# EAGLE schematic DUE_V02g (EAGLE 9.6.2)

## Sheet 1 of 2
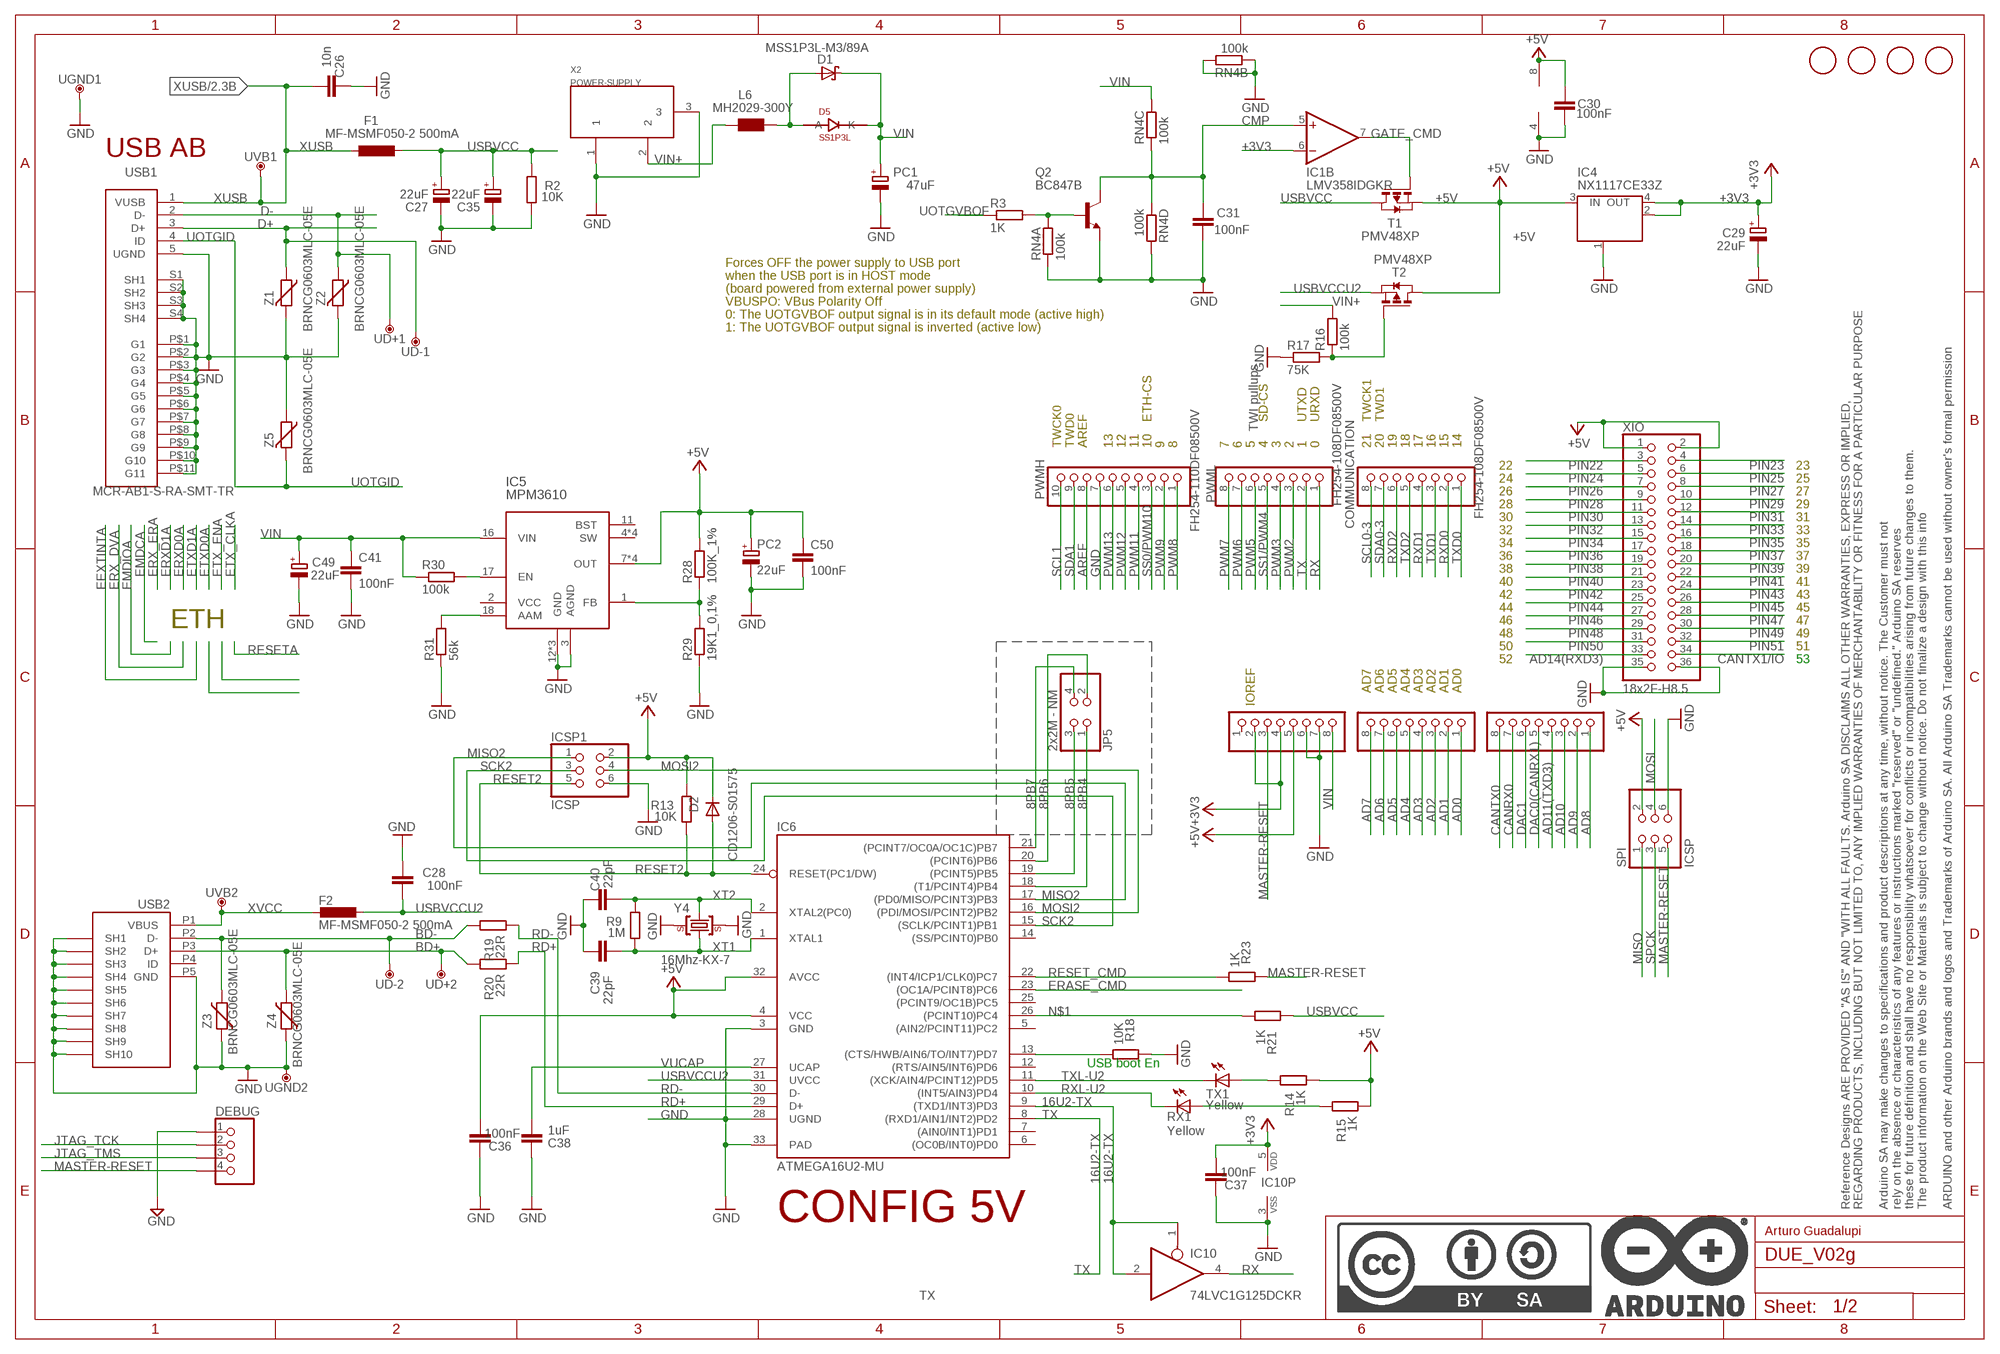
[diagram p0: schematic, sheet 1]

### Parts
ADCH  FH254-108DF08500V  1683_20TW-536  [1X08]
ADCL  FH254-108DF08500V  1683_20TW-536  [1X08]
C26  10n  0165_10NF_0402  [C0402]
C27  22uF  0167_  [SMC_B]
C28  100nF  0132_100NF_0402  [C0402]
C29  22uF  0167_  [SMC_B]
C30  100nF  0132_100NF_0402  [C0402]
C31  100nF  0132_100NF_0402  [C0402]
C35  22uF  0167_  [SMC_B]
C36  100nF  0132_100NF_0402  [C0402]
C37  100nF  0132_100NF_0402  [C0402]
C38  1uF  0133_1UF_0402  [C0402]
C39  22pF  0137_22PF_0402  [C0402]
C40  22pF  0137_22PF_0402  [C0402]
C41  100nF  0015_100NF_0603  [C0603-ROUND]
C49  22uF  0167_  [SMC_B]
C50  100nF  0015_100NF_0603  [C0603-ROUND]
COMMUNICATION  FH254-108DF08500V  1683_20TW-536  [1X08]
D1  MSS1P3L-M3/89A  1653_MSS1P3L-M3/89A  [MICROSMP]
D2  CD1206-S01575  0012_CD1206-S01575  [MINIMELF]
D5  SS1P3L  0025_SS1P3L-M3/84A  [DO220AAL]
DEBUG  0644_4X1VP.2,54H11,8  [PH1X4-THT]
F1  MF-MSMF050-2 500mA  0002_MF-MSMF050-2  [L1812]
F2  MF-MSMF050-2 500mA  0002_MF-MSMF050-2  [L1812]
FID1  FIDUCIALMOUNT  [FIDUCIA-MOUNT]
FID2  FIDUCIALMOUNT  [FIDUCIA-MOUNT]
FID3  FIDUCIALMOUNT  [FIDUCIA-MOUNT]
FID4  FIDUCIALMOUNT  [FIDUCIA-MOUNT]
IC1  LMV358IDGKR  0021_LMV358IDGKR  [MSOP08]
IC4  NX1117CE33Z  0045_NX1117CE33Z,115  [SOT223]
IC5  MPM3610  2093_MPM3610GQV-P  [QFN-20]
IC6  ATMEGA16U2-MU  0007_ATMEGA16U2-MUR  [MLF32]
IC10  74LVC1G125DCKR  0040_SN74LVC1G125DCKR  [SC70-5]
ICSP1  ICSP  0114_PH254-203DF118A00V  [2X03]
JP5  2x2M - NM  XXXX_PINHD-2X2  [2X02]
L6  MH2029-300Y  0001_BLM21PG300SN1D_/_MH2029-300Y  [0805]
PC1  47uF  0113_47UF  [PANASONIC_D]
PC2  22uF  0167_  [SMC_B]
POWER  FH254-108DF08500V  1683_20TW-536  [1X08]
PWMH  FH254-110DF08500V  1684_20TW-537  [1X10]
PWML  FH254-108DF08500V  1683_20TW-536  [1X08]
Q2  BC847B  0169_BC847B  [SOT23]
R2  10K  0136_CR0402FX1002_L  [R0402]
R3  1K  0140_1K_0402  [R0402]
R9  1M  0139_1M_0402  [R0402]
R13  10K  0136_CR0402FX1002_L  [R0402]
R14  1K  0140_1K_0402  [R0402]
R15  1K  0140_1K_0402  [R0402]
R16  100k  0134_CR0402FX1003L  [R0402]
R17  75K  0376_CR0603FX7502_L  [R0603-ROUND]
R18  10K  0136_CR0402FX1002_L  [R0402]
R19  22R  0468_22R_0402  [R0402]
R20  22R  0468_22R_0402  [R0402]
R21  1K  0140_1K_0402  [R0402]
R23  1K  0140_1K_0402  [R0402]
R28  100K_1%  2022_CR0603FW104L  [R0603-ROUND]
R29  19K1_0,1%  2339_  [R0603-ROUND]
R30  100k  0026_100K_0603  [R0603-ROUND]
R31  56k  0411_56K_0603  [R0603-ROUND]
RN4  100k  0168_CAY16-104J4LF  [CAY16]
RX1  Yellow  0044_KPT-2012YC  [CHIPLED_0805]
SPI  ICSP  0114_PH254-203DF118A00V  [2X03]
T1  PMV48XP  0297_PMV48XP  [SOT-23]
T2  PMV48XP  0297_PMV48XP  [SOT-23]
TX1  Yellow  0044_KPT-2012YC  [CHIPLED_0805]
U$1  DNP  A3-FRAME  [FRAME]
UD+1  DNP  TPTP-1.00MM  [TP-1.00MM]
UD+2  DNP  TPTP-1.00MM  [TP-1.00MM]
UD-1  DNP  TPTP-1.00MM  [TP-1.00MM]
UD-2  DNP  TPTP-1.00MM  [TP-1.00MM]
UGND1  DNP  TPTP-1.00MM  [TP-1.00MM]
UGND2  DNP  TPTP-1.00MM  [TP-1.00MM]
USB1  MCR-AB1-S-RA-SMT-TR  0631_MCR-AB1-S-RA-SMT-TR  [MCR-AB1-S-RA-SMT]
USB2  MCR-B-S-RA-SMT-CS1TR  0158_MCR-B-S-RA-SMT-CS1TR  [CON2_USB_MICRO_B_AT]
UVB1  DNP  TPTP-1.00MM  [TP-1.00MM]
UVB2  DNP  TPTP-1.00MM  [TP-1.00MM]
X2  POWER-SUPPLY  0018_19746-POWER-SUPPLY  [POWERSUPPLY_DC-21MM]
XIO  18x2F-H8.5  1756_12TW323  [2X18]
Y4  16Mhz-KX-7  0395_16.000MHZ__12PF  [CRYSTAL-3.2-2.5]
Z1  BRNCG0603MLC-05E  0010_BRNCG0603MLC-05E  [CT/CN0603]
Z2  BRNCG0603MLC-05E  0010_BRNCG0603MLC-05E  [CT/CN0603]
Z3  BRNCG0603MLC-05E  0010_BRNCG0603MLC-05E  [CT/CN0603]
Z4  BRNCG0603MLC-05E  0010_BRNCG0603MLC-05E  [CT/CN0603]
Z5  BRNCG0603MLC-05E  0010_BRNCG0603MLC-05E  [CT/CN0603]

### Nets
8PB4: IC6.18((T1/PCINT4)PB4) JP5.1
8PB5: IC6.19((PCINT5)PB5) JP5.3
8PB6: IC6.20((PCINT6)PB6) JP5.2
8PB7: IC6.21((PCINT7/OC0A/OC1C)PB7) JP5.4
16U2-TX: IC6.9((TXD1/INT3)PD3) IC10.1(OE) IC10.2(I)
+3V3: C29.+ C37.1 IC1.6(B:-IN) IC4.2(OUT) IC4.4(OUT) IC10.5(VDD) POWER.2 POWER.4 ; also sheet 2
+5V: C30.2 C36.1 C50.1 D2.C IC1.8(P:V+) IC4.3(IN) IC5.7(OUT) IC5.8(OUT) IC5.9(OUT) IC5.20(OUT) IC6.4(VCC) IC6.32(AVCC) ICSP1.2 PC2.+ POWER.5 R13.2 R14.1 R15.1 R28.2 SPI.2 T1.2(S) T2.1(D) XIO.1 XIO.2
AD0: ADCL.1 ; also sheet 2
AD1: ADCL.2 ; also sheet 2
AD2: ADCL.3 ; also sheet 2
AD3: ADCL.4 ; also sheet 2
AD4: ADCL.5 ; also sheet 2
AD5: ADCL.6 ; also sheet 2
AD6: ADCL.7 ; also sheet 2
AD7: ADCL.8 ; also sheet 2
AD8: ADCH.1 ; also sheet 2
AD9: ADCH.2 ; also sheet 2
AD10: ADCH.3 ; also sheet 2
AD11(TXD3): ADCH.4 ; also sheet 2
AD14(RXD3): XIO.33 ; also sheet 2
AREF: PWMH.8 ; also sheet 2
BD+ [USB]: R20.2 UD+2.X USB2.P3(D+) Z4.2
BD- [USB]: R19.2 UD-2.X USB2.P2(D-) Z3.2
CANRX0: ADCH.7 ; also sheet 2
CANTX0: ADCH.8 ; also sheet 2
CANTX1/IO: XIO.34 ; also sheet 2
CMP: C31.2 IC1.5(B:+IN) Q2.3(C) RN4.3 RN4.4
D+ [USBpair]: UD-1.X USB1.3(D+) Z1.1 ; also sheet 2
D- [USBpair]: UD+1.X USB1.2(D-) Z2.1 ; also sheet 2
DAC0(CANRX1): ADCH.5 ; also sheet 2
DAC1: ADCH.6 ; also sheet 2
DTR: IC6.13((CTS/HWB/AIN6/TO/INT7)PD7) R18.1
ERASE_CMD: IC6.23((OC1A/PCINT8)PC6) ; also sheet 2
GATE_CMD: IC1.7(B:OUT) T1.3(G)
GND: C26.2 C27.- C28.2 C29.- C30.1 C31.1 C35.- C36.2 C37.2 C38.2 C39.2 C40.2 C41.2 C49.- C50.2 DEBUG.1 IC1.4(P:V-) IC4.1(GND/ADJ) IC5.3(AGND) IC5.12(GND) IC5.13(GND) IC5.14(GND) IC6.3(GND) IC6.28(UGND) IC6.33(PAD) IC10.3(VSS) ICSP1.6 PC1.- PC2.- POWER.6 POWER.7 PWMH.7 Q2.2(E) R2.1 R17.1 R18.2 R29.1 R31.1 RN4.1 RN4.2 RN4.5 RN4.7 SPI.6 UGND1.X UGND2.X USB1.5(UGND) USB1.P$1(G1) USB1.P$2(G2) USB1.P$3(G3) USB1.P$4(G4) USB1.P$5(G5) USB1.P$6(G6) USB1.P$7(G7) USB1.P$8(G8) USB1.P$9(G9) USB1.P$10(G10) USB1.P$11(G11) USB1.S1(SH1) USB1.S2(SH2) USB1.S3(SH3) USB1.S4(SH4) USB2.P5(GND) USB2.P$1(SH7) USB2.P$2(SH8) USB2.P$3(SH9) USB2.P$4(SH10) USB2.P$5(SH7) USB2.P$6(SH8) USB2.P$7(SH9) USB2.P$8(SH10) USB2.S1(SH1) USB2.S2(SH2) USB2.S3(SH3) USB2.S4(SH4) USB2.S5(SH5) USB2.S6(SH6) X2.1 X2.3 XIO.35 XIO.36 Y4.2(GND) Y4.4(GND) Z1.2 Z2.2 Z3.1 Z4.1 Z5.1 ; also sheet 2
JTAG_TCK: DEBUG.2 ; also sheet 2
JTAG_TMS: DEBUG.3 ; also sheet 2
MASTER-RESET: DEBUG.4 POWER.3 R23.2 SPI.5 ; also sheet 2
MISO: SPI.1 ; also sheet 2
MISO2: IC6.17((PD0/MISO/PCINT3)PB3) ICSP1.1
MOSI: SPI.4 ; also sheet 2
MOSI2: IC6.16((PDI/MOSI/PCINT2)PB2) ICSP1.4
N$1: IC6.26((PCINT10)PC4) R21.1
N$4: R15.2 RX1.A
N$6: Q2.1(B) R3.2 RN4.8
N$10: D1.A D5.P$2(A) L6.1
N$14: R14.2 TX1.A
N$15: R16.1 R17.2 T2.3(G)
N$35: IC5.1(FB) R28.1 R29.2
N$36: IC5.17(EN) R30.2
N$37: IC5.18(AAM) R31.2
PIN22: XIO.3 ; also sheet 2
PIN23: XIO.4 ; also sheet 2
PIN24: XIO.5 ; also sheet 2
PIN25: XIO.6 ; also sheet 2
PIN26: XIO.7 ; also sheet 2
PIN27: XIO.8 ; also sheet 2
PIN28: XIO.9 ; also sheet 2
PIN29: XIO.10 ; also sheet 2
PIN30: XIO.11 ; also sheet 2
PIN31: XIO.12 ; also sheet 2
PIN32: XIO.13 ; also sheet 2
PIN33: XIO.14 ; also sheet 2
PIN34: XIO.15 ; also sheet 2
PIN35: XIO.16 ; also sheet 2
PIN36: XIO.17 ; also sheet 2
PIN37: XIO.18 ; also sheet 2
PIN38: XIO.19 ; also sheet 2
PIN39: XIO.20 ; also sheet 2
PIN40: XIO.21 ; also sheet 2
PIN41: XIO.22 ; also sheet 2
PIN42: XIO.23 ; also sheet 2
PIN43: XIO.24 ; also sheet 2
PIN44: XIO.25 ; also sheet 2
PIN45: XIO.26 ; also sheet 2
PIN46: XIO.27 ; also sheet 2
PIN47: XIO.28 ; also sheet 2
PIN48: XIO.29 ; also sheet 2
PIN49: XIO.30 ; also sheet 2
PIN50: XIO.31 ; also sheet 2
PIN51: XIO.32 ; also sheet 2
PWM2: PWML.3 ; also sheet 2
PWM3: PWML.4 ; also sheet 2
PWM5: PWML.6 ; also sheet 2
PWM6: PWML.7 ; also sheet 2
PWM7: PWML.8 ; also sheet 2
PWM8: PWMH.1 ; also sheet 2
PWM9: PWMH.2 ; also sheet 2
PWM11: PWMH.4 ; also sheet 2
PWM12: PWMH.5 ; also sheet 2
PWM13: PWMH.6 ; also sheet 2
RD+: IC6.29(D+) R20.1
RD-: IC6.30(D-) R19.1
RESET2: D2.A IC6.24(RESET(PC1/DW)) ICSP1.5 R13.1
RESET_CMD: IC6.22((INT4/ICP1/CLK0)PC7) R23.1
RX: IC10.4(O) PWML.1 ; also sheet 2
RXD0: COMMUNICATION.2 ; also sheet 2
RXD1: COMMUNICATION.4 ; also sheet 2
RXD2: COMMUNICATION.6 ; also sheet 2
RXL-U2: IC6.10((INT5/AIN3)PD4) RX1.C
SCK2: IC6.15((SCLK/PCINT1)PB1) ICSP1.3
SCL0-3: COMMUNICATION.8 ; also sheet 2
SCL1: PWMH.10 ; also sheet 2
SDA0-3: COMMUNICATION.7 ; also sheet 2
SDA1: PWMH.9 ; also sheet 2
SPCK: SPI.3 ; also sheet 2
SS0/PWM10: PWMH.3 ; also sheet 2
SS1/PWM4: PWML.5 ; also sheet 2
TX: IC6.8((RXD1/AIN1/INT2)PD2) PWML.2 ; also sheet 2
TXD0: COMMUNICATION.1 ; also sheet 2
TXD1: COMMUNICATION.3 ; also sheet 2
TXD2: COMMUNICATION.5 ; also sheet 2
TXL-U2: IC6.11((XCK/AIN4/PCINT12)PD5) TX1.C
UOTGID: USB1.4(ID) Z5.2 ; also sheet 2
UOTGVBOF: R3.1 ; also sheet 2
USBVCC: C27.+ C35.+ F1.1 R2.2 R21.2 T1.1(D)
USBVCCU2: C28.1 F2.1 IC6.31(UVCC) T2.2(S)
VIN: C41.1 C49.+ D1.K(C) D5.P$1(K) IC5.16(VIN) PC1.+ POWER.8 R30.1 RN4.6
VIN+: L6.2 R16.2 X2.2
VUCAP: C38.1 IC6.27(UCAP)
XT1: C39.1 IC6.1(XTAL1) R9.1 Y4.1(C1)
XT2: C40.1 IC6.2(XTAL2(PC0)) R9.2 Y4.3(C2)
XUSB [usbvcc]: C26.1 F1.2 USB1.1(VUSB) UVB1.X ; also sheet 2
XVCC [usbvcc]: F2.2 USB2.P1(VBUS) UVB2.X
Unconnected: IC5.2(VCC) IC5.4(SW) IC5.5(SW) IC5.6(SW) IC5.11(BST) IC5.19(SW) IC6.5((AIN2/PCINT11)PC2) IC6.6((OC0B/INT0)PD0) IC6.7((AIN0/INT1)PD1) IC6.12((RTS/AIN5/INT6)PD6) IC6.14((SS/PCINT0)PB0) IC6.25((PCINT9/OC1B)PC5) POWER.1 USB2.P4(ID)

### Notes on the sheet
- USB AB
- Forces OFF the power supply to USB port
- when the USB port is in HOST mode
- (board powered from external power supply)
- VBUSPO: VBus Polarity Off
- 0: The UOTGVBOF output signal is in its default mode (active high)
- 1: The UOTGVBOF output signal is inverted (active low)
- ETH-CS | SD-CS | UTXD | URXD | TWCK1 | TWD1
- TWI pullups
- TWCK0 | TWD0 | AREF | 13 | 12 | 11 | 10 | 9 | 8 | 7 | 6 | 5 | 4 | 3 | 2 | 1 | 0 | 21 | 20 | 19 | 18 | 17 | 16 | 15 | 14
- 22 | 23
- 24 | 25
- 26 | 27
- 28 | 29
- 30 | 31
- 32 | 33
- 34 | 35
- 36 | 37
- 38 | 39
- 40 | 41
- 42 | 43
- 44 | 45
- 46 | 47
- ETH | 48 | 49
- 50 | 51
- 52 | 53
- AD7 | AD6 | AD5 | AD4 | AD3 | AD2 | AD1 | AD0
- IOREF
- USB boot En
- CONFIG 5V
- Arturo Guadalupi

## Sheet 2 of 2
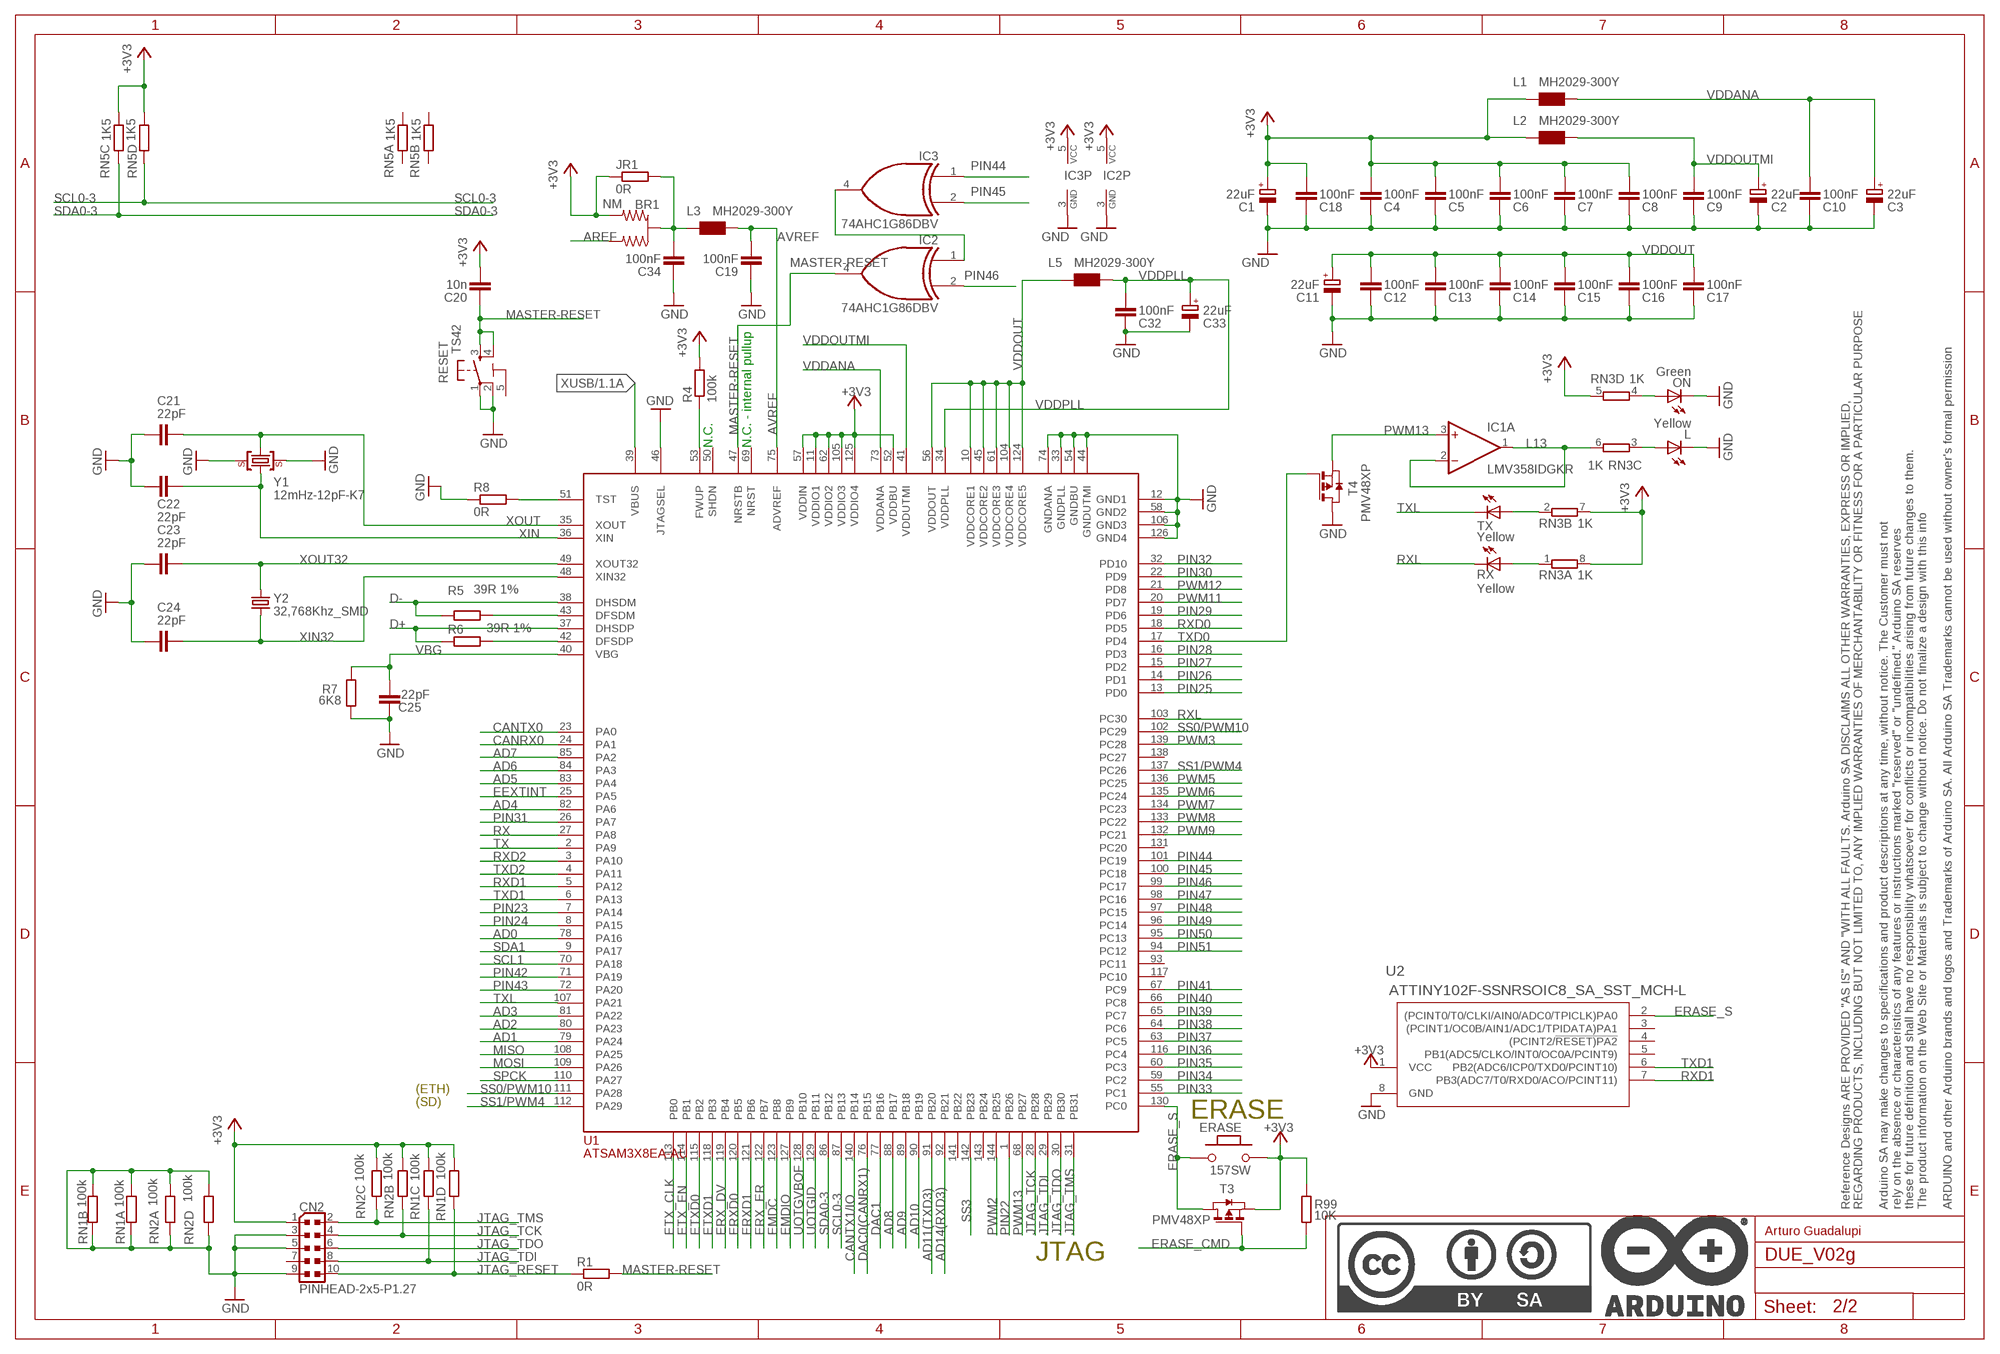
[diagram p1: schematic, sheet 2]

### Parts
BR1  NM  J0402  [J0402]
C1  22uF  0167_  [SMC_B]
C2  22uF  0167_  [SMC_B]
C3  22uF  0167_  [SMC_B]
C4  100nF  0132_100NF_0402  [C0402]
C5  100nF  0132_100NF_0402  [C0402]
C6  100nF  0132_100NF_0402  [C0402]
C7  100nF  0132_100NF_0402  [C0402]
C8  100nF  0132_100NF_0402  [C0402]
C9  100nF  0132_100NF_0402  [C0402]
C10  100nF  0132_100NF_0402  [C0402]
C11  22uF  0167_  [SMC_B]
C12  100nF  0132_100NF_0402  [C0402]
C13  100nF  0132_100NF_0402  [C0402]
C14  100nF  0132_100NF_0402  [C0402]
C15  100nF  0132_100NF_0402  [C0402]
C16  100nF  0132_100NF_0402  [C0402]
C17  100nF  0132_100NF_0402  [C0402]
C18  100nF  0132_100NF_0402  [C0402]
C19  100nF  0132_100NF_0402  [C0402]
C20  10n  0165_10NF_0402  [C0402]
C21  22pF  0137_22PF_0402  [C0402]
C22  22pF  0137_22PF_0402  [C0402]
C23  22pF  0137_22PF_0402  [C0402]
C24  22pF  0137_22PF_0402  [C0402]
C25  22pF  0137_22PF_0402  [C0402]
C32  100nF  0132_100NF_0402  [C0402]
C33  22uF  0167_  [SMC_B]
C34  100nF  0132_100NF_0402  [C0402]
CN2  PINHEAD-2x5-P1.27  0171_PH127-205DF055G00AROUND-PADS  [PINHEAD_2X05_127]
ERASE  157SW  0173_IT-1185AP1C-160G-G_T&R  [SMD_157SW]
IC2  74AHC1G86DBV  [SOT23-5]
IC3  74AHC1G86DBV  [SOT23-5]
JR1  0R  0039_JUMP_0402  [R0402]
L  Yellow  0044_KPT-2012YC  [CHIPLED_0805]
L1  MH2029-300Y  0001_BLM21PG300SN1D_/_MH2029-300Y  [0805]
L2  MH2029-300Y  0001_BLM21PG300SN1D_/_MH2029-300Y  [0805]
L3  MH2029-300Y  0001_BLM21PG300SN1D_/_MH2029-300Y  [0805]
L5  MH2029-300Y  0001_BLM21PG300SN1D_/_MH2029-300Y  [0805]
ON  Green  0043_KPT-2012SGC  [CHIPLED_0805]
R1  0R  0039_JUMP_0402  [R0402]
R4  100k  0134_CR0402FX1003L  [R0402]
R5  39R 1%  0138_39R_0402  [R0402]
R6  39R 1%  0138_39R_0402  [R0402]
R7  6K8  0164_6K8_0603  [R0603-ROUND]
R8  0R  0039_JUMP_0402  [R0402]
R99  10K  0136_CR0402FX1002_L  [R0402]
RESET  TS42  0946_TS42031-160W-TR-7260  [TS42]
RN1  100k  0168_CAY16-104J4LF  [CAY16]
RN2  100k  0168_CAY16-104J4LF  [CAY16]
RN3  1K  0005_064R_1K_/_CAY16-102J4LF  [CAY16]
RN5  1K5  0163_1K5_ARRAY  [CAY16]
RX  Yellow  0044_KPT-2012YC  [CHIPLED_0805]
T3  PMV48XP  0297_PMV48XP  [SOT-23]
T4  PMV48XP  0297_PMV48XP  [SOT-23]
TX  Yellow  0044_KPT-2012YC  [CHIPLED_0805]
U1  ATSAM3X8EA-AU  0162_ATSAM3X8EA-AUAU  [LQFP144]
U2  ATTINY102F-SSNRSOIC8_SA_SST_MCH-L  [SOIC8_SA_SST_MCH-L]
U$2  DNP  A3-FRAME  [FRAME]
Y1  12mHz-12pF-K7  0396_12MHZ-12PF-K7  [CRYSTAL-3.2-2.5]
Y2  32,768Khz_SMD  0213_ABS07-32.768KHZ-T  [RESONATOR_EPSON_FC_145]

### Nets
+3V3: BR1.3 C1.+ C4.2 C5.2 C6.2 C7.2 C8.2 C18.2 C20.2 CN2.1 ERASE.1 IC2.5(VCC) IC3.5(VCC) JR1.1 L1.1 L2.1 R4.2 R99.2 RN1.5 RN1.6 RN2.2 RN2.3 RN3.5 RN3.7 RN3.8 RN5.3 RN5.4 T3.2(S) U1.11(VDDIO1) U1.52(VDDBU) U1.57(VDDIN) U1.62(VDDIO2) U1.105(VDDIO3) U1.125(VDDIO4) U2.1(VCC) ; also sheet 1
AD0: U1.78(PA16) ; also sheet 1
AD1: U1.79(PA24) ; also sheet 1
AD2: U1.80(PA23) ; also sheet 1
AD3: U1.81(PA22) ; also sheet 1
AD4: U1.82(PA6) ; also sheet 1
AD5: U1.83(PA4) ; also sheet 1
AD6: U1.84(PA3) ; also sheet 1
AD7: U1.85(PA2) ; also sheet 1
AD8: U1.88(PB17) ; also sheet 1
AD9: U1.89(PB18) ; also sheet 1
AD10: U1.90(PB19) ; also sheet 1
AD11(TXD3): U1.91(PB20) ; also sheet 1
AD14(RXD3): U1.92(PB21) ; also sheet 1
AREF: BR1.1 ; also sheet 1
AVREF: C19.2 L3.2 U1.75(ADVREF)
AVREFL: BR1.2(C) C34.2 JR1.2 L3.1
CANRX0: U1.24(PA1) ; also sheet 1
CANTX0: U1.23(PA0) ; also sheet 1
CANTX1/IO: U1.140(PB14) ; also sheet 1
D+ [USBpair]: R6.1 U1.37(DHSDP) ; also sheet 1
D- [USBpair]: R5.1 U1.38(DHSDM) ; also sheet 1
DAC0(CANRX1): U1.76(PB15) ; also sheet 1
DAC1: U1.77(PB16) ; also sheet 1
EEXTINT: U1.25(PA5)
EMDC: U1.123(PB8)
EMDIO: U1.127(PB9)
ERASE_CMD: R99.1 T3.3(G) ; also sheet 1
ERASE_S: ERASE.2 T3.1(D) U1.130(PC0) U2.2((PCINT0/T0/CLKI/AIN0/ADC0/TPICLK)PA0)
ERX_DV: U1.119(PB4)
ERX_ER: U1.122(PB7)
ERXD0: U1.120(PB5)
ERXD1: U1.121(PB6)
ETX_CLK: U1.113(PB0)
ETX_EN: U1.114(PB1)
ETXD0: U1.115(PB2)
ETXD1: U1.118(PB3)
GND: C1.- C2.- C3.- C4.1 C5.1 C6.1 C7.1 C8.1 C9.1 C10.1 C11.- C12.1 C13.1 C14.1 C15.1 C16.1 C17.1 C18.1 C19.1 C21.2 C22.2 C23.2 C24.2 C25.2 C32.1 C33.- C34.1 CN2.3 CN2.5 CN2.9 IC2.3(GND) IC3.3(GND) L.C ON.C R7.1 R8.1 RESET.1 RESET.2 RN1.1 RN1.2 RN1.7 RN1.8 RN2.1 RN2.4 RN2.5 RN2.8 T4.1(D) U1.12(GND1) U1.33(GNDPLL) U1.44(GNDUTMI) U1.46(JTAGSEL) U1.54(GNDBU) U1.58(GND2) U1.74(GNDANA) U1.106(GND3) U1.126(GND4) U2.8(GND) Y1.2(GND) Y1.4(GND) ; also sheet 1
JTAG_RESET: CN2.10 R1.1 RN1.4
JTAG_TCK: CN2.4 RN2.7 U1.28(PB28) ; also sheet 1
JTAG_TDI: CN2.8 RN1.3 U1.29(PB29)
JTAG_TDO: CN2.6 U1.30(PB30)
JTAG_TMS: CN2.2 RN2.6 U1.31(PB31) ; also sheet 1
L13: IC1.1(A:OUT) IC1.2(A:-IN) RN3.6
MASTER-RESET: C20.1 IC2.4(O) R1.2 RESET.3 RESET.4 U1.47(NRSTB) ; also sheet 1
MISO: U1.108(PA25) ; also sheet 1
MOSI: U1.109(PA26) ; also sheet 1
N$2: L.A RN3.3
N$3: ON.A RN3.4
N$5: R8.2 U1.51(TST)
N$7: R4.1 U1.53(FWUP)
N$11: R5.2 U1.43(DFSDM)
N$12: R6.2 U1.42(DFSDP)
N$13: IC2.1(I0) IC3.4(O)
N$54: RN3.1 RX.A
N$55: RN3.2 TX.A
PIN22: U1.1(PB26) ; also sheet 1
PIN23: U1.7(PA14) ; also sheet 1
PIN24: U1.8(PA15) ; also sheet 1
PIN25: U1.13(PD0) ; also sheet 1
PIN26: U1.14(PD1) ; also sheet 1
PIN27: U1.15(PD2) ; also sheet 1
PIN28: U1.16(PD3) ; also sheet 1
PIN29: U1.19(PD6) ; also sheet 1
PIN30: U1.22(PD9) ; also sheet 1
PIN31: U1.26(PA7) ; also sheet 1
PIN32: U1.32(PD10) ; also sheet 1
PIN33: U1.55(PC1) ; also sheet 1
PIN34: U1.59(PC2) ; also sheet 1
PIN35: U1.60(PC3) ; also sheet 1
PIN36: U1.116(PC4) ; also sheet 1
PIN37: U1.63(PC5) ; also sheet 1
PIN38: U1.64(PC6) ; also sheet 1
PIN39: U1.65(PC7) ; also sheet 1
PIN40: U1.66(PC8) ; also sheet 1
PIN41: U1.67(PC9) ; also sheet 1
PIN42: U1.71(PA19) ; also sheet 1
PIN43: U1.72(PA20) ; also sheet 1
PIN44: IC3.1(I0) U1.101(PC19) ; also sheet 1
PIN45: IC3.2(I1) U1.100(PC18) ; also sheet 1
PIN46: IC2.2(I1) U1.99(PC17) ; also sheet 1
PIN47: U1.98(PC16) ; also sheet 1
PIN48: U1.97(PC15) ; also sheet 1
PIN49: U1.96(PC14) ; also sheet 1
PIN50: U1.95(PC13) ; also sheet 1
PIN51: U1.94(PC12) ; also sheet 1
PWM2: U1.144(PB25) ; also sheet 1
PWM3: U1.139(PC28) ; also sheet 1
PWM5: U1.136(PC25) ; also sheet 1
PWM6: U1.135(PC24) ; also sheet 1
PWM7: U1.134(PC23) ; also sheet 1
PWM8: U1.133(PC22) ; also sheet 1
PWM9: U1.132(PC21) ; also sheet 1
PWM11: U1.20(PD7) ; also sheet 1
PWM12: U1.21(PD8) ; also sheet 1
PWM13: IC1.3(A:+IN) T4.2(S) U1.68(PB27) ; also sheet 1
RX: U1.27(PA8) ; also sheet 1
RXD0: U1.18(PD5) ; also sheet 1
RXD1: U1.5(PA12) U2.7(PB3(ADC7/T0/RXD0/ACO/PCINT11)) ; also sheet 1
RXD2: U1.3(PA10) ; also sheet 1
RXL: RX.C U1.103(PC30)
SCL0-3: RN5.5 U1.87(PB13) ; also sheet 1
SCL1: U1.70(PA18) ; also sheet 1
SDA0-3: RN5.6 U1.86(PB12) ; also sheet 1
SDA1: U1.9(PA17) ; also sheet 1
SPCK: U1.110(PA27) ; also sheet 1
SS0/PWM10: U1.102(PC29) U1.111(PA28) ; also sheet 1
SS1/PWM4: U1.112(PA29) U1.137(PC26) ; also sheet 1
SS3: U1.142(PB23)
TX: U1.2(PA9) ; also sheet 1
TXD0: T4.3(G) U1.17(PD4) ; also sheet 1
TXD1: U1.6(PA13) U2.6(PB2(ADC6/ICP0/TXD0/PCINT10)) ; also sheet 1
TXD2: U1.4(PA11) ; also sheet 1
TXL: TX.C U1.107(PA21)
UOTGID: U1.129(PB11) ; also sheet 1
UOTGVBOF: U1.128(PB10) ; also sheet 1
VBG: C25.1 R7.2 U1.40(VBG)
VDDANA: C3.+ C10.2 L1.2 U1.73(VDDANA)
VDDOUT: C11.+ C12.2 C13.2 C14.2 C15.2 C16.2 C17.2 L5.1 U1.10(VDDCORE1) U1.45(VDDCORE2) U1.56(VDDOUT) U1.61(VDDCORE3) U1.104(VDDCORE4) U1.124(VDDCORE5)
VDDOUTMI: C2.+ C9.2 L2.2 U1.41(VDDUTMI)
VDDPLL: C32.2 C33.+ L5.2 U1.34(VDDPLL)
XIN: C22.1 U1.36(XIN) Y1.1(C1)
XIN32: C24.1 U1.48(XIN32) Y2.P$2
XOUT: C21.1 U1.35(XOUT) Y1.3(C2)
XOUT32: C23.1 U1.49(XOUT32) Y2.P$1
XUSB [usbvcc]: U1.39(VBUS) ; also sheet 1
Unconnected: CN2.7 RN5.1 RN5.2 RN5.7 RN5.8 U1.50(SHDN) U1.69(NRST) U1.93(PC11) U1.117(PC10) U1.131(PC20) U1.138(PC27) U1.141(PB22) U1.143(PB24) U2.3((PCINT1/OC0B/AIN1/ADC1/TPIDATA)PA1) U2.4((PCINT2/!RESET)PA2) U2.5(PB1(ADC5/CLKO/INT0/OC0A/PCINT9))

### Notes on the sheet
- N.C. | N.C. - internal pullup
- (ETH)
- (SD)
- ERASE
- Arturo Guadalupi
- JTAG

## Power pins joined to a net without a drawn wire
5-GND: RESET.5(5-GND)

## Library data of the parts
ADCH ADCL COMMUNICATION POWER PWML = Connettori:1683_20TW-536: Female Gray Connector strip for Arduino 3V3 bases - 8x1 F V h 8,5 p2,54mm; MONTHLY_USAGE: _____; PART_NUMBER: 20TW-536; PRICE: _____; SUPPLIER: _____; TYPE: Connettori
BR1 = bibaja:J: Three terminal jumper made from two 0402, 0603, 0805, etc.
C1-C3 C11 C27 C29 C33 C35 C49 PC2 = Condensatori:0167_: 22uF 25V; MONTHLY_USAGE: _____; PRICE: _____; SUPPLIER: _____; TYPE: Condensatori
C4-C10 C12-C19 C28 C30-C32 C34 C36 C37 = Condensatori:0132_100NF_0402: 100nF 0402; CASE: 0402; MONTHLY_USAGE: _____; PART_NUMBER: 100nF_0402; PRICE: _____; SUPPLIER: _____; TYPE: Condensatori
C20 C26 = Condensatori:0165_10NF_0402: 10nF 0402
C21-C25 C39 C40 = Condensatori:0137_22PF_0402: 22pF 0402; CASE: 0402; MONTHLY_USAGE: _____; PART_NUMBER: 22pF_0402; PRICE: _____; SUPPLIER: _____; TYPE: Condensatori
C38 = Condensatori:0133_1UF_0402: 1uF 0402; CASE: 0402; MONTHLY_USAGE: _____; PART_NUMBER: 1uF_0402; PRICE: _____; SUPPLIER: _____; TYPE: Condensatori
C41 C50 = Condensatori:0015_100NF_0603: 100nF 0603 50V; CASE: 0603; MONTHLY_USAGE: _____; PART_NUMBER: cl10b104kbnc; PRICE: _____; SUPPLIER: _____; TYPE: Condensatori
CN2 = Connettori:0171_PH127-205DF055G00A: 2x5 PASSO 1,27
D1 = Diodi:1653_MSS1P3L-M3/89A: Surface Mount Schottky Barrier Rectifiers - Case microSMP
D2 = Diodi:0012_CD1206-S01575: small-signal high-speed Switching Diodes CD1206; CASE: 1206; MONTHLY_USAGE: _____; PART_NUMBER: CD1206-S01575; PRICE: _____; SUPPLIER: _____; TYPE: Diodi
D5 = Diodi:0025_SS1P3L-M3/84A: 1A 30V Schottky Barrier Rectifiers -SS1P3L-M3/84A; CASE: SMP; MONTHLY_USAGE: _____; PART_NUMBER: SS1P3L-M3/84A; PRICE: _____; SUPPLIER: _____; TYPE: Diodi
DEBUG = Connettori:0644_4X1VP.2,54H11,8: 4x1 V P.2,54 H11,8
ERASE = Switches:0173_IT-1185AP1C-160G-G_T&R: Pushbutton 4x3 SMD H2,5mm; MONTHLY_USAGE: _____; PART_NUMBER: IT-1185AP1C-160G-G_T&R; PRICE: _____; SUPPLIER: _____; TYPE: Switches
F1 F2 = Protezione:0002_MF-MSMF050-2: 500 mA Multifuse � Polyfuse; MONTHLY_USAGE: _____; PART_NUMBER: MF-MSMF050-2; PRICE: _____; SUPPLIER: _____; TYPE: Protezione
FID1-FID4 = SmartPrj:FIDUCIALMOUNT
IC1 = IntegratedCircuits:0021_LMV358IDGKR: Dual low-voltage (2.7 V to 5.5 V), operational amplifiers with rail-to-rail output swing LMV358IDGKR; CASE: MSOP8; MONTHLY_USAGE: _____; PART_NUMBER: LMV358IDGKR; PRICE: _____; SUPPLIER: _____; TYPE: Circuito_Integrato
IC2 IC3 = 74xx-little-us:74*1G86: 2-input EXCLUSIV-OR gate
IC4 = IntegratedCircuits:0045_NX1117CE33Z,115: Low-dropout linear regulator 3V3 NX1117CE33Z,115; CASE: SOT223; MONTHLY_USAGE: _____; PART_NUMBER: NX1117CE33Z,115; PRICE: _____; SUPPLIER: _____; TYPE: Circuito_Integrato
IC5 = IntegratedCircuits:2093_MPM3610GQV-P: MPM3610 Step Down Regulator; CASE: QFN-20; PART_NUMBER: MPM3610GQV-P; TYPE: Circuito_Integrato
IC6 = IntegratedCircuits:0007_ATMEGA16U2-MUR: 8-bit Microcontroller with 16K Bytes of ISP Flash and USB Controller ATMEGA16U2-MUR; CASE: QFN32_5x5; MONTHLY_USAGE: _____; PART_NUMBER: ATMEGA16U2-MUR; PRICE: _____; SUPPLIER: _____; TYPE: Circuito_Integrato
IC10 = IntegratedCircuits:0040_SN74LVC1G125DCKR: Single bus buffer with 3-state output; CASE: SC70; MONTHLY_USAGE: _____; PART_NUMBER: SN74LVC1G125DCKR; PRICE: _____; SUPPLIER: _____; TYPE: Circuito_Integrato
ICSP1 SPI = Connettori:0114_PH254-203DF118A00V: 3x2 M V h 8,5 mm p2,54; MONTHLY_USAGE: _____; PART_NUMBER: PH254-203DF118A00V; PRICE: _____; SUPPLIER: _____; TYPE: Connettori
JP5 = Connettori:XXXX_PINHD-2X2: PIN HEADER
JR1 R1 R8 = Resistenze:0039_JUMP_0402: 0R 0402; CASE: 0402; MONTHLY_USAGE: _____; PART_NUMBER: JUMP_0402; PRICE: _____; SUPPLIER: _____; TYPE: Resistenze
L RX RX1 TX TX1 = Opto:0044_KPT-2012YC: LED YELLOW - SMD - 0805; MONTHLY_USAGE: _____; PART_NUMBER: KPT-2012YC; PRICE: _____; SUPPLIER: _____; TYPE: Opto
L1-L3 L5 L6 = Protezione:0001_BLM21PG300SN1D_/_MH2029-300Y: BLM21; MONTHLY_USAGE: _____; PART_NUMBER: BLM21PG300SN1D_/_MH2029-300Y; PRICE: _____; SUPPLIER: _____; TYPE: Protezione
ON = Opto:0043_KPT-2012SGC: LED GREEN - SMD-0805; MONTHLY_USAGE: _____; PART_NUMBER: KPT-2012SGC; PRICE: _____; SUPPLIER: _____; TYPE: Opto
PC1 = Condensatori:0113_47UF: 47uF; MONTHLY_USAGE: _____; PART_NUMBER: 47uF; PRICE: _____; SUPPLIER: _____; TYPE: Condensatori
PWMH = Connettori:1684_20TW-537: Female Gray Connector strip for Arduino 3V3 bases - 10x1 F V h 8,5 p2,54mm; MONTHLY_USAGE: _____; PART_NUMBER: 20TW-537; PRICE: _____; SUPPLIER: _____; TYPE: Connettori
Q2 = Transistors:0169_BC847B: BC847BSMD; MONTHLY_USAGE: _____; PART_NUMBER: BC847B; PRICE: _____; SUPPLIER: _____; TYPE: Transistor
R2 R13 R18 R99 = Resistenze:0136_CR0402FX1002_L: 10K 0402; CASE: 0402; MONTHLY_USAGE: _____; PART_NUMBER: CR0402FX1002_L; PRICE: _____; SUPPLIER: _____; TYPE: Resistenze
R3 R14 R15 R21 R23 = Resistenze:0140_1K_0402: 1K 0402; CASE: 0402; MONTHLY_USAGE: _____; PART_NUMBER: 1K_0402; PRICE: _____; SUPPLIER: _____; TYPE: Resistenze
R4 R16 = Resistenze:0134_CR0402FX1003L: 100K 0402; CASE: 0402; PART_NUMBER: CR0402FX1003 L; TYPE: Resistenze
R5 R6 = Resistenze:0138_39R_0402: 39R 0402
R7 = Resistenze:0164_6K8_0603: 6K8 0603; CASE: 0603; MONTHLY_USAGE: _____; PART_NUMBER: 6K8_0603; PRICE: _____; SUPPLIER: _____; TYPE: Resistenze
R9 = Resistenze:0139_1M_0402: 1M 0402; CASE: 0402; MONTHLY_USAGE: _____; PART_NUMBER: 1M_0402; PRICE: _____; SUPPLIER: _____; TYPE: Resistenze
R17 = Resistenze:0376_CR0603FX7502_L: 75K 0603; CASE: 0603; MONTHLY_USAGE: _____; PART_NUMBER: CR0603FX7502_L; PRICE: _____; SUPPLIER: _____; TYPE: Resistenze
R19 R20 = Resistenze:0468_22R_0402: 22R 0402; CASE: 0402; MONTHLY_USAGE: _____; PART_NUMBER: 22R_0402; PRICE: _____; SUPPLIER: _____; TYPE: Resistenze
R28 = Resistenze:2022_CR0603FW104L: 0603 Resistor 100K 1%; PART_NUMBER: CR0603FW104L
R29 = Resistenze:2339_: 19K1 0,1% 0603; CASE: 0603; MONTHLY_USAGE: _____; PRICE: _____; SUPPLIER: _____; TYPE: Resistenze
R30 = Resistenze:0026_100K_0603: 100K 0603; CASE: 0603; MONTHLY_USAGE: _____; PART_NUMBER: 100K_0603; PRICE: _____; SUPPLIER: _____; TYPE: Resistenze
R31 = Resistenze:0411_56K_0603: 56K 0603; CASE: 0603; MONTHLY_USAGE: _____; PART_NUMBER: 56K_0603; PRICE: _____; SUPPLIER: _____; TYPE: Resistenze
RESET = Switches:0946_TS42031-160W-TR-7260: Pushbutton 6x6 Smd - White; MONTHLY_USAGE: _____; PART_NUMBER: IT-1157AHNP-160G-G_GTR; PRICE: _____; SUPPLIER: _____; TYPE: Switches
RN1 RN2 RN4 = Resistenze:0168_CAY16-104J4LF: 100K 064 R; CASE: SMD 3,2x1,6; PART_NUMBER: CAY16-104J4LF; TYPE: Resistenze
RN3 = Resistenze:0005_064R_1K_/_CAY16-102J4LF: 1K 064R; CASE: SMD_3,2x1,6; MONTHLY_USAGE: _____; PART_NUMBER: 064R_1K_/_CAY16-102J4LF; PRICE: _____; SUPPLIER: _____; TYPE: Resistenze
RN5 = Resistenze:0163_1K5_ARRAY: 1K5 064 R
T1-T4 = Transistors:0297_PMV48XP: 20 V, 3.5 A P-channel Trench MOSFET - PMV48XP; CASE: SOT23; MONTHLY_USAGE: _____; PART_NUMBER: PMV48XP; PRICE: _____; SUPPLIER: _____; TYPE: Transistor
U1 = IntegratedCircuits:0162_ATSAM3X8EA-AU: AT91SAM ARM-based Flash MCU ATSAM3X8EA-AU; CASE: LQFP144; PART_NUMBER: ATSAM3X8EA-AU; TYPE: Circuito_Integrato
U2 = ATTINY102F:ATTINY102F-SSNR; BUILT_BY: EMA_Molly; COPYRIGHT: Copyright (C) 2018 Accelerated Designs. All rights reserved; MANUFACTURER_PART_NUMBER: ATTINY102F-SSNR; SOURCELIBRARY: Microchip_2019-08-23_25; VENDOR: Microchip
U$1 U$2 = Arduino-utility:A3-FRAME; CODE-ARDUINO: DNP; DATASHEET: DNP; DISTRIBUTOR-LINK: DNP; DISTRIBUTOR-PN: DNP; MANUFACTURER: DNP; MANUFACTURER-PN: DNP; NOTE: DNP
UD+1 UD+2 UD-1 UD-2 UGND1 UGND2 UVB1 UVB2 = Arduino-utility:TP: Testpoint; DATASHEET: DNP; DISTRIBUTOR-LINK: DNP; DISTRIBUTOR-PN: DNP; MANUFACTURER: DNP; MANUFACTURER-PN: DNP
USB1 = Connettori:0631_MCR-AB1-S-RA-SMT-TR: Usb Micro F/90 Smd Tipo AB; MONTHLY_USAGE: _____; PART_NUMBER: MCR-AB1-S-RA-SMT-TR; PRICE: _____; SUPPLIER: _____; TYPE: Connettori
USB2 = Connettori:0158_MCR-B-S-RA-SMT-CS1TR: Usb Micro F/90 Smd Tipo B; MONTHLY_USAGE: _____; PART_NUMBER: MCR-B-S-RA-SMT-CS1TR; PRICE: _____; SUPPLIER: _____; TYPE: Connettori
X2 = Connettori:0018_19746-POWER-SUPPLY: JACK; MONTHLY_USAGE: _____; PART_NUMBER: 19746; PRICE: _____; SUPPLIER: _____; TYPE: Connettori
XIO = Connettori:1756_12TW323: Female Gray Connector strip for Arduino 3V3 bases 18x2 F V h 8,5 p2,54; MONTHLY_USAGE: _____; PART_NUMBER: 12TW323; PRICE: _____; SUPPLIER: _____; TYPE: Connettori
Y1 = Cristalli:0396_12MHZ-12PF-K7: 12Mhz - K7 12pF - SMD
Y2 = Cristalli:0213_ABS07-32.768KHZ-T: 32,768KHz - SMD; MONTHLY_USAGE: _____; PART_NUMBER: ABS07-32.768KHZ-T; PRICE: _____; SUPPLIER: _____; TYPE: Cristalli
Y4 = Cristalli:0395_16.000MHZ__12PF: 16Mhz - K7 12pF - SMD; MONTHLY_USAGE: _____; PART_NUMBER: 16.000Mhz__12pF; PRICE: _____; SUPPLIER: _____; TYPE: Cristalli
Z1-Z5 = Protezione:0010_BRNCG0603MLC-05E: CG0603MLC-05E; MONTHLY_USAGE: _____; PART_NUMBER: BRNCG0603MLC-05E; PRICE: _____; SUPPLIER: _____; TYPE: Protezione

## Net classes
0 default: width 0.203 mm, drill 0.406 mm, clearance 0.203 mm
1 USB: width 0.203 mm, drill 0.406 mm, clearance 0.203 mm
2 gnd: width 0.203 mm, drill 0.406 mm, clearance 0.203 mm
3 usbvcc: width 0.203 mm, drill 0.406 mm, clearance 0.203 mm
4 USBpair: width 0.254 mm, drill 0.406 mm, clearance 0.61 mm to class 0, clearance 0.61 mm to class 1, clearance 0.61 mm to class 2, clearance 0.61 mm to class 3